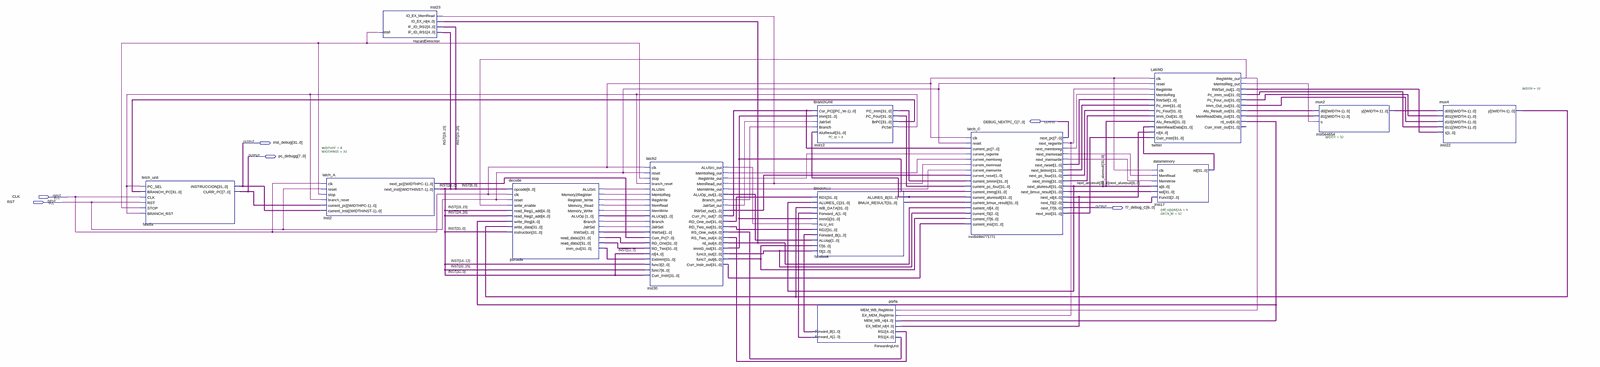
[diagram p0: schematic sheet, whole]
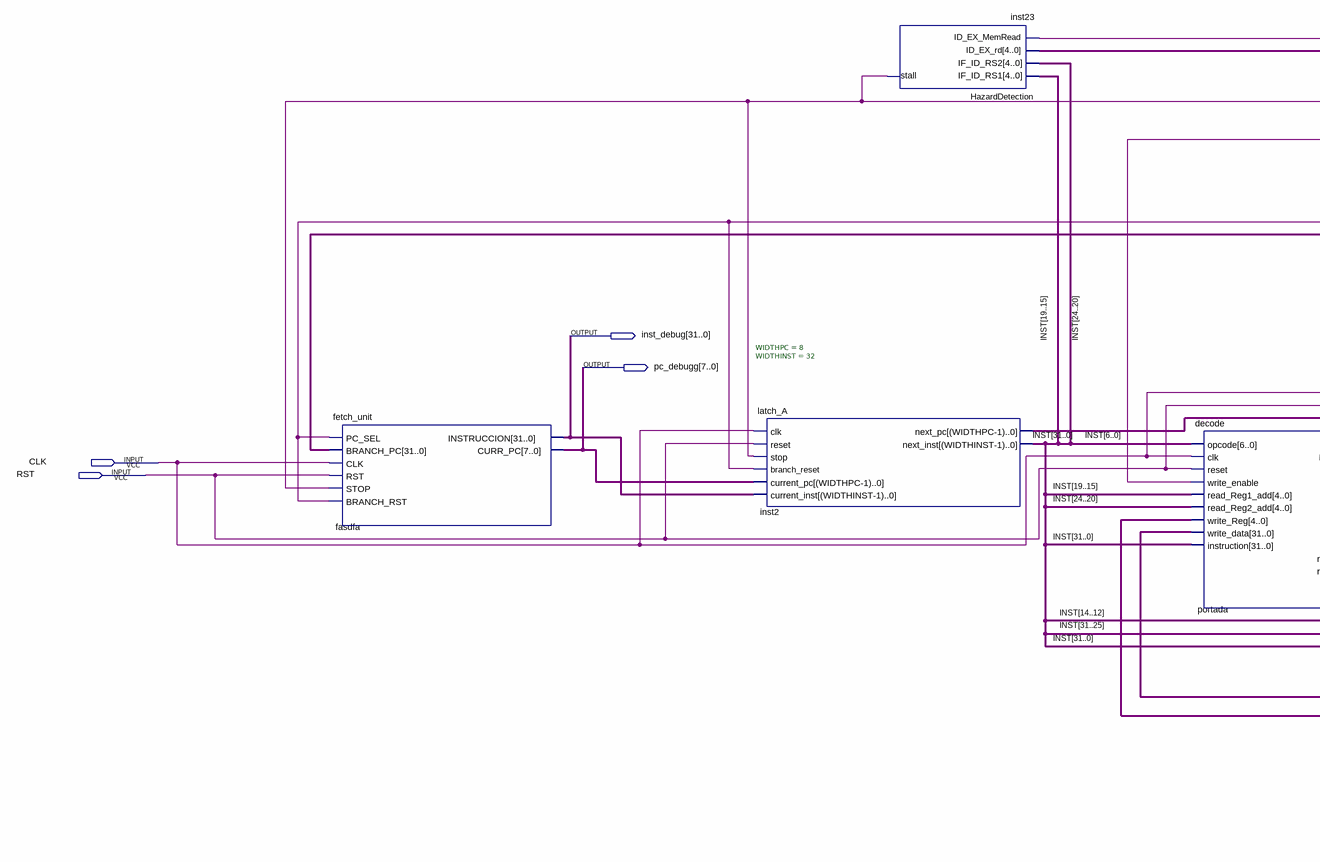
[diagram p1: schematic sheet, left part]
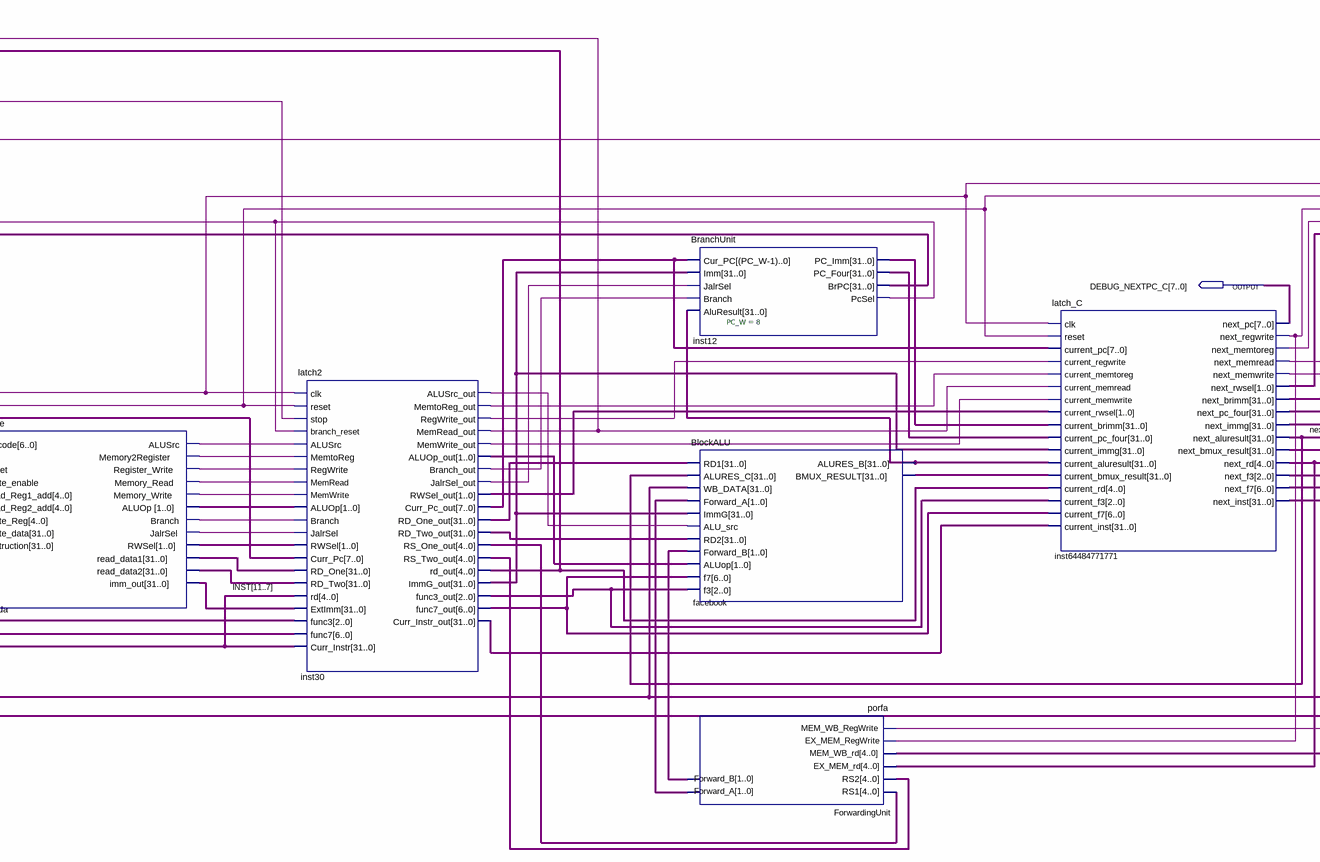
[diagram p2: schematic sheet, centre part]
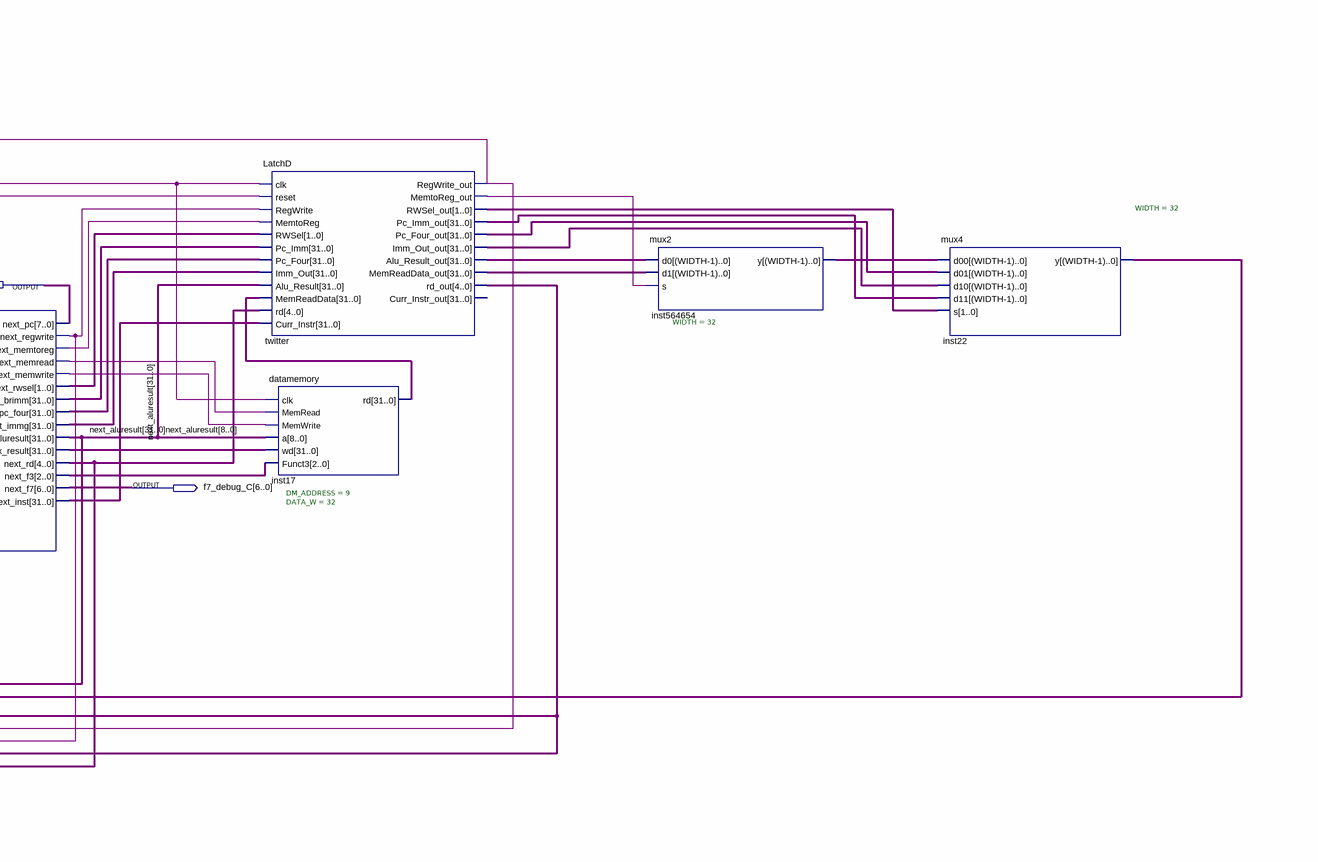
[diagram p3: schematic sheet, right part]
// Quartus schematic TP2_E5.bdf as structural Verilog: 13 symbols, 6 pins
module TP2_E5 (
  input  CLK,
  input  RST,
  output [7:0] DEBUG_NEXTPC_C,
  output [31:0] inst_debug,
  output [7:0] pc_debugg,
  output [6:0] f7_debug_C
);

  wire inst12_pcsel, inst23_stall, inst30_alusrc_out, inst30_branch_out, inst30_jalrsel_out,
       inst30_memread_out, inst30_memtoreg_out, inst30_memwrite_out, inst30_regwrite_out,
       inst64484771771_next_memread, inst64484771771_next_memtoreg, inst64484771771_next_memwrite,
       inst64484771771_next_regwrite, portada_alusrc, portada_branch, portada_jalrsel,
       portada_memory2register, portada_memory_read, portada_memory_write, portada_register_write,
       twitter_memtoreg_out, twitter_regwrite_out;
  wire [1:0] inst30_aluop_out, inst30_rwsel_out, inst64484771771_next_rwsel, porfa_forward_a,
       porfa_forward_b, portada_aluop, portada_rwsel, twitter_rwsel_out;
  wire [2:0] inst30_func3_out, inst64484771771_next_f3;
  wire [4:0] inst30_rd_out, inst30_rs_one_out, inst30_rs_two_out, inst64484771771_next_rd, twitter_rd_out;
  wire [6:0] inst30_func7_out;
  wire [7:0] inst2_next_pc, inst30_curr_pc_out;
  wire [31:0] facebook_alures_b, facebook_bmux_result, INST, inst12_brpc, inst12_pc_four, inst12_pc_imm,
       inst17_rd, inst22_y, inst30_curr_instr_out, inst30_immg_out, inst30_rd_one_out, inst30_rd_two_out,
       inst564654_y, inst64484771771_next_bmux_result, inst64484771771_next_brimm, inst64484771771_next_immg,
       inst64484771771_next_inst, inst64484771771_next_pc_four, next_aluresult, portada_imm_out,
       portada_read_data1, portada_read_data2, twitter_alu_result_out, twitter_imm_out_out,
       twitter_memreaddata_out, twitter_pc_four_out, twitter_pc_imm_out;

  fetch_unit fasdfa (
    .PC_SEL(inst12_pcsel), .BRANCH_PC(inst12_brpc), .CLK(CLK), .RST(RST), .STOP(inst23_stall),
    .BRANCH_RST(inst12_pcsel), .INSTRUCCION(inst_debug), .CURR_PC(pc_debugg));
  latch_A #(.WIDTHPC(8), .WIDTHINST(32)) inst2 (
    .clk(CLK), .reset(RST), .stop(inst23_stall), .branch_reset(inst12_pcsel), .current_pc(pc_debugg),
    .current_inst(inst_debug), .next_pc(inst2_next_pc), .next_inst(INST));
  HazardDetection inst23 (
    .IF_ID_RS1(INST[19:15]), .IF_ID_RS2(INST[24:20]), .ID_EX_rd(inst30_rd_out),
    .ID_EX_MemRead(inst30_memread_out), .stall(inst23_stall));
  decode portada (
    .opcode(INST[6:0]), .clk(CLK), .reset(RST), .write_enable(twitter_regwrite_out),
    .read_Reg1_add(INST[19:15]), .read_Reg2_add(INST[24:20]), .write_Reg(twitter_rd_out),
    .write_data(inst22_y), .instruction(INST), .ALUSrc(portada_alusrc),
    .Memory2Register(portada_memory2register), .Register_Write(portada_register_write),
    .Memory_Read(portada_memory_read), .Memory_Write(portada_memory_write), .ALUOp(portada_aluop),
    .Branch(portada_branch), .JalrSel(portada_jalrsel), .RWSel(portada_rwsel),
    .read_data1(portada_read_data1), .read_data2(portada_read_data2), .imm_out(portada_imm_out));
  latch2 inst30 (
    .clk(CLK), .reset(RST), .stop(inst23_stall), .branch_reset(inst12_pcsel), .ALUSrc(portada_alusrc),
    .MemtoReg(portada_memory2register), .RegWrite(portada_register_write), .MemRead(portada_memory_read),
    .MemWrite(portada_memory_write), .ALUOp(portada_aluop), .Branch(portada_branch),
    .JalrSel(portada_jalrsel), .RWSel(portada_rwsel), .Curr_Pc(inst2_next_pc), .RD_One(portada_read_data1),
    .RD_Two(portada_read_data2), .rd(INST[11:7]), .ExtImm(portada_imm_out), .func3(INST[14:12]),
    .func7(INST[31:25]), .Curr_Instr(INST), .ALUSrc_out(inst30_alusrc_out),
    .MemtoReg_out(inst30_memtoreg_out), .RegWrite_out(inst30_regwrite_out), .MemRead_out(inst30_memread_out),
    .MemWrite_out(inst30_memwrite_out), .ALUOp_out(inst30_aluop_out), .Branch_out(inst30_branch_out),
    .JalrSel_out(inst30_jalrsel_out), .RWSel_out(inst30_rwsel_out), .Curr_Pc_out(inst30_curr_pc_out),
    .RD_One_out(inst30_rd_one_out), .RD_Two_out(inst30_rd_two_out), .RS_One_out(inst30_rs_one_out),
    .RS_Two_out(inst30_rs_two_out), .rd_out(inst30_rd_out), .ImmG_out(inst30_immg_out),
    .func3_out(inst30_func3_out), .func7_out(inst30_func7_out), .Curr_Instr_out(inst30_curr_instr_out));
  BranchUnit #(.PC_W(8)) inst12 (
    .Cur_PC(inst30_curr_pc_out), .Imm(inst30_immg_out), .JalrSel(inst30_jalrsel_out),
    .Branch(inst30_branch_out), .AluResult(facebook_alures_b), .PC_Imm(inst12_pc_imm),
    .PC_Four(inst12_pc_four), .BrPC(inst12_brpc), .PcSel(inst12_pcsel));
  BlockALU facebook (
    .RD1(inst30_rd_one_out), .ALURES_C(next_aluresult), .WB_DATA(inst22_y), .Forward_A(porfa_forward_a),
    .ImmG(inst30_immg_out), .ALU_src(inst30_alusrc_out), .RD2(inst30_rd_two_out),
    .Forward_B(porfa_forward_b), .ALUop(inst30_aluop_out), .f7(inst30_func7_out), .f3(inst30_func3_out),
    .ALURES_B(facebook_alures_b), .BMUX_RESULT(facebook_bmux_result));
  ForwardingUnit porfa (
    .RS1(inst30_rs_one_out), .RS2(inst30_rs_two_out), .EX_MEM_rd(inst64484771771_next_rd),
    .MEM_WB_rd(twitter_rd_out), .EX_MEM_RegWrite(inst64484771771_next_regwrite),
    .MEM_WB_RegWrite(twitter_regwrite_out), .Forward_A(porfa_forward_a), .Forward_B(porfa_forward_b));
  latch_C inst64484771771 (
    .clk(CLK), .reset(RST), .current_pc(inst30_curr_pc_out), .current_regwrite(inst30_regwrite_out),
    .current_memtoreg(inst30_memtoreg_out), .current_memread(inst30_memread_out),
    .current_memwrite(inst30_memwrite_out), .current_rwsel(inst30_rwsel_out), .current_brimm(inst12_pc_imm),
    .current_pc_four(inst12_pc_four), .current_immg(inst30_immg_out), .current_aluresult(facebook_alures_b),
    .current_bmux_result(facebook_bmux_result), .current_rd(inst30_rd_out), .current_f3(inst30_func3_out),
    .current_f7(inst30_func7_out), .current_inst(inst30_curr_instr_out), .next_pc(DEBUG_NEXTPC_C),
    .next_regwrite(inst64484771771_next_regwrite), .next_memtoreg(inst64484771771_next_memtoreg),
    .next_memread(inst64484771771_next_memread), .next_memwrite(inst64484771771_next_memwrite),
    .next_rwsel(inst64484771771_next_rwsel), .next_brimm(inst64484771771_next_brimm),
    .next_pc_four(inst64484771771_next_pc_four), .next_immg(inst64484771771_next_immg),
    .next_aluresult(next_aluresult), .next_bmux_result(inst64484771771_next_bmux_result),
    .next_rd(inst64484771771_next_rd), .next_f3(inst64484771771_next_f3), .next_f7(f7_debug_C),
    .next_inst(inst64484771771_next_inst));
  LatchD twitter (
    .clk(CLK), .reset(RST), .RegWrite(inst64484771771_next_regwrite),
    .MemtoReg(inst64484771771_next_memtoreg), .RWSel(inst64484771771_next_rwsel),
    .Pc_Imm(inst64484771771_next_brimm), .Pc_Four(inst64484771771_next_pc_four),
    .Imm_Out(inst64484771771_next_immg), .Alu_Result(next_aluresult), .MemReadData(inst17_rd),
    .rd(inst64484771771_next_rd), .Curr_Instr(inst64484771771_next_inst),
    .RegWrite_out(twitter_regwrite_out), .MemtoReg_out(twitter_memtoreg_out), .RWSel_out(twitter_rwsel_out),
    .Pc_Imm_out(twitter_pc_imm_out), .Pc_Four_out(twitter_pc_four_out), .Imm_Out_out(twitter_imm_out_out),
    .Alu_Result_out(twitter_alu_result_out), .MemReadData_out(twitter_memreaddata_out),
    .rd_out(twitter_rd_out));  // open: Curr_Instr_out
  datamemory #(.DM_ADDRESS(9), .DATA_W(32)) inst17 (
    .clk(CLK), .MemRead(inst64484771771_next_memread), .MemWrite(inst64484771771_next_memwrite),
    .a(next_aluresult[8:0]), .wd(inst64484771771_next_bmux_result), .Funct3(inst64484771771_next_f3),
    .rd(inst17_rd));
  mux2 #(.WIDTH(32)) inst564654 (
    .d0(twitter_alu_result_out), .d1(twitter_memreaddata_out), .s(twitter_memtoreg_out), .y(inst564654_y));
  mux4 #(.WIDTH(32)) inst22 (
    .d00(inst564654_y), .d01(twitter_pc_four_out), .d10(twitter_imm_out_out), .d11(twitter_pc_imm_out),
    .s(twitter_rwsel_out), .y(inst22_y));
endmodule
